# EAGLE schematic PartiBadge-v2 (EAGLE 9.1.3)
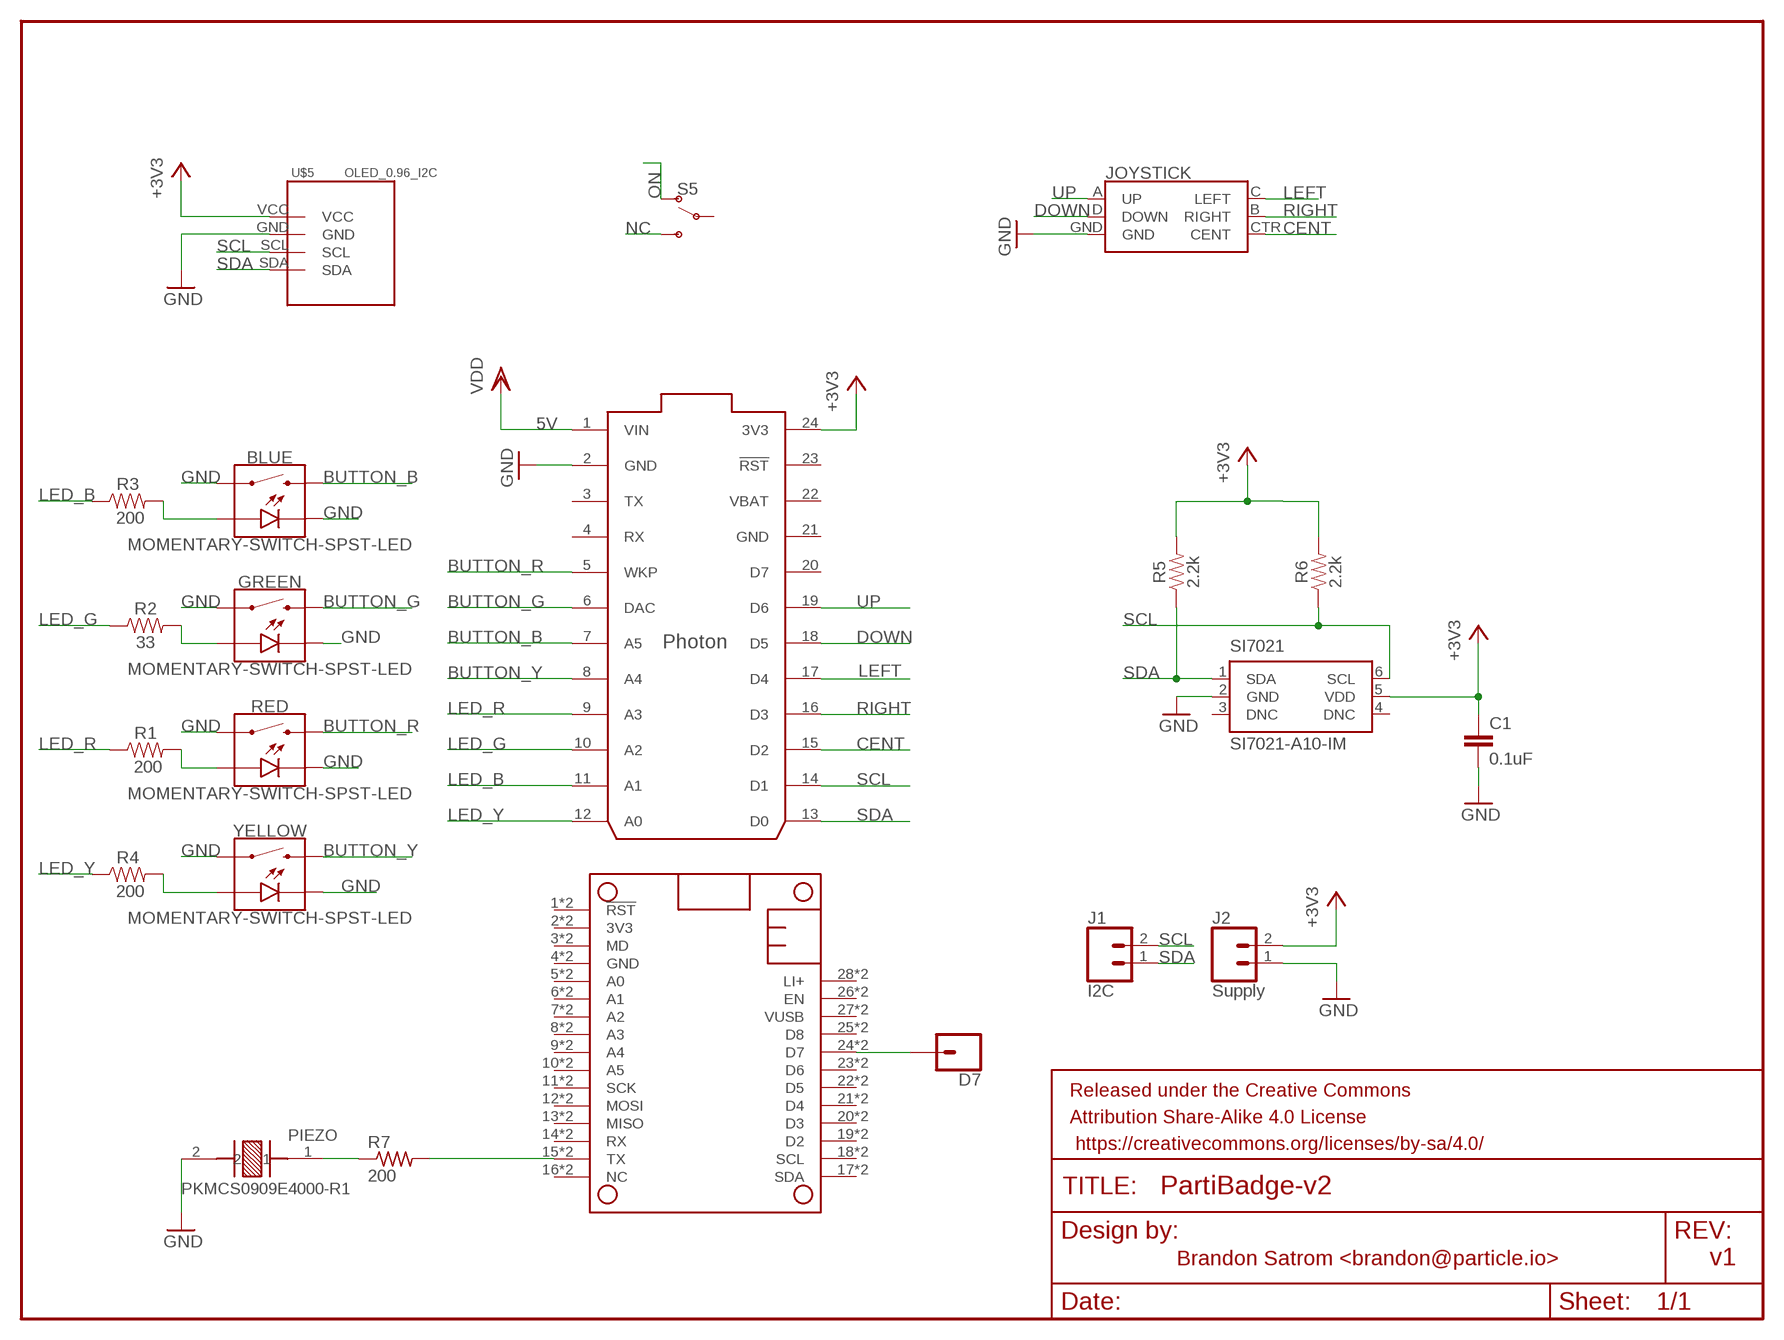
[diagram p0: schematic, sheet 1]

## Parts
BLUE  MOMENTARY-SWITCH-SPST-LED  MOMENTARY-SWITCH-SPST-LED-PTH-12MM-KIT  [TACTILE_SWITCH_LED_PTH_12MM_KIT]
C1  0.1uF  0.1UF-0603-25V-(+80/-20%)  [0603]
D7  CONN_01  [1X01]
GREEN  MOMENTARY-SWITCH-SPST-LED  MOMENTARY-SWITCH-SPST-LED-PTH-12MM-KIT  [TACTILE_SWITCH_LED_PTH_12MM_KIT]
J1  I2C  CONN_02  [1X02]
J2  Supply  CONN_02  [1X02]
JOYSTICK  JOYSTICK_MINI  [JOYSTICK_MINI]
MS1  PARTICLE_MESH_SMTDUAL  [FEATHERWING_SMT2]
PARTIFRAME  FRAME-LETTERNO_PACKAGE  [DUMMY]
PHOTON  PHOTON_WITH_HEADERS  [PHOTON]
PIEZO  PKMCS0909E4000-R1  [XDCR_PKMCS0909E4000-R1]
R1  200  RESISTOR1206  [1206]
R2  33  RESISTOR1206  [1206]
R3  200  RESISTOR1206  [1206]
R4  200  RESISTOR1206  [1206]
R5  2.2k  4.7KOHM-0603-1/10W-1%  [0603]
R6  2.2k  4.7KOHM-0603-1/10W-1%  [0603]
R7  200  R-US_M0805  [M0805]
RED  MOMENTARY-SWITCH-SPST-LED  MOMENTARY-SWITCH-SPST-LED-PTH-12MM-KIT  [TACTILE_SWITCH_LED_PTH_12MM_KIT]
S5  SWITCH-SPDT-PTH-11.6X4.0MM  [SWITCH_SPDT_PTH_11.6X4.0MM]
SI7021  SI7021-A10-IM  [DFN6-3X3]
U$5  OLED_0.96_I2C  [OLED_0.96_I2C]
YELLOW  MOMENTARY-SWITCH-SPST-LED  MOMENTARY-SWITCH-SPST-LED-PTH-12MM-KIT  [TACTILE_SWITCH_LED_PTH_12MM_KIT]

## Nets
5V: PHOTON.1(VIN) ; supply symbol labelled VDD
+3V3: C1.1 J2.2 PHOTON.24(3V3) R5.2 R6.2 SI7021.5(VDD) U$5.VCC
BUTTON_B: BLUE.2 PHOTON.7(A5)
BUTTON_G: GREEN.2 PHOTON.6(DAC)
BUTTON_R: PHOTON.5(WKP) RED.2
BUTTON_Y: PHOTON.8(A4) YELLOW.2
CENT: JOYSTICK.CTR(CENT) PHOTON.15(D2)
DOWN: JOYSTICK.D(DOWN) PHOTON.18(D5)
GND: BLUE.4 BLUE.C C1.2 GREEN.4 GREEN.C J2.1 JOYSTICK.GND PHOTON.2(GND) PIEZO.2 RED.4 RED.C SI7021.2(GND) U$5.GND YELLOW.4 YELLOW.C
LED_B: PHOTON.11(A1) R3.1
LED_G: PHOTON.10(A2) R2.1
LED_R: PHOTON.9(A3) R1.1
LED_Y: PHOTON.12(A0) R4.1
LEFT: JOYSTICK.C(LEFT) PHOTON.17(D4)
N$1: D7.1 MS1.24'(D7) MS1.24(D7)
N$2: MS1.15'(TX) MS1.15(TX) R7.2
N$4: R1.2 RED.A
N$7: GREEN.A R2.2
N$8: BLUE.A R3.2
N$10: R4.2 YELLOW.A
N$13: PIEZO.1 R7.1
NC: S5.3(S)
ON: S5.1(O)
RIGHT: JOYSTICK.B(RIGHT) PHOTON.16(D3)
SCL: J1.2 PHOTON.14(D1) R6.1 SI7021.6(SCL) U$5.SCL
SDA: J1.1 PHOTON.13(D0) R5.1 SI7021.1(SDA) U$5.SDA
UP: JOYSTICK.A(UP) PHOTON.19(D6)
Unconnected: MS1.1'(!RST) MS1.1(!RST) MS1.2'(3V3) MS1.2(3V3) MS1.3'(MD) MS1.3(MD) MS1.5'(A0) MS1.5(A0) MS1.6'(A1) MS1.6(A1) MS1.7'(A2) MS1.7(A2) MS1.8'(A3) MS1.8(A3) MS1.9'(A4) MS1.9(A4) MS1.10'(A5) MS1.10(A5) MS1.11'(SCK) MS1.11(SCK) MS1.12'(MOSI) MS1.12(MOSI) MS1.13'(MISO) MS1.13(MISO) MS1.14'(RX) MS1.14(RX) MS1.16'(NC) MS1.16(NC) MS1.17'(SDA) MS1.17(SDA) MS1.18'(SCL) MS1.18(SCL) MS1.19'(D2) MS1.19(D2) MS1.20'(D3) MS1.20(D3) MS1.21'(D4) MS1.21(D4) MS1.22'(D5) MS1.22(D5) MS1.23'(D6) MS1.23(D6) MS1.25'(D8) MS1.25(D8) MS1.26'(EN) MS1.26(EN) MS1.27'(VUSB) MS1.27(VUSB) MS1.28'(LI+) MS1.28(LI+) PHOTON.3(TX) PHOTON.4(RX) PHOTON.20(D7) PHOTON.23(!RST) S5.2(P) SI7021.3(DNC) SI7021.4(DNC)

## Notes on the sheet
- Brandon Satrom <brandon@particle.io> | v1

## Power pins joined to a net without a drawn wire
GND: MS1.4'(GND) MS1.4(GND) PHOTON.21(GND)
VBAT: PHOTON.22(VBAT)

## Library data of the parts
BLUE GREEN RED YELLOW = SparkFun-Switches:MOMENTARY-SWITCH-SPST-LED: Momentary Switch (Pushbutton) - SPST - w/ LED Normally-open (NO) SPST momentary switches (buttons, pushbuttons), with a built-in LED. Variants PTH-CHERRY - Cherry MX Switch Cherry MX Keyswitches are top-of-the-line mechanical keyboard switches. They’re satisfyingly “clicky”, reliable up to tens-of-millions of key presses, and a standard in gaming and programming keyboards across the globe. This ‘blue’ version Cherry MX Switch is favored by most due to its secondary internal actuator making it less likely to “double-tap.” If you are looking for a noticeably audible and high-quality key switch, this is the perfect option for you! Cherry MX Switch <https://www.sparkfun.com/products/13834> (COM-13834) Cherry MX Switch Breakout <https://www.sparkfun.com/products/13773> (BOB-13773) PTH-12MM and PTH-12MM-KIT - 12mm Illuminated LED KIT variant is for soldering kits. There is no tStop (covering up the top side of the pads with mask). This helps the beginner see which side they should be soldering too. LED Tactile Button Breakout <https://www.sparkfun.com/products/10467> (BOB-10467) LED Tactile Button - Red <https://www.sparkfun.com/products/10442> (COM-10442) LED Tactile Button - Blue <https://www.sparkfun.com/products/10443> (COM-10443) LED Tactile Button - Green <https://www.sparkfun.com/products/10440> (COM-10440) LED Tactile Button - Orange <https://www.sparkfun.com/products/10441> (COM-10441) LED Tactile Button - White <https://www.sparkfun.com/products/10439> (COM-10439); PROD_ID: SWCH-11758; SF_SKU: COM-10442
C1 = SparkFun-Capacitors:0.1UF: 0.1µF ceramic capacitors A capacitor is a passive two-terminal electrical component used to store electrical energy temporarily in an electric field.; PROD_ID: CAP-00810
D7 = SparkFun-Connectors:CONN_01: Single connection point. Often used as Generic Header-pin footprint for 0.1 inch spaced/style header connections On any of the 0.1 inch spaced packages, you can populate with these: Break Away Headers - Straight <https://www.sparkfun.com/products/116> (PRT-00116) Break Away Male Headers - Right Angle <https://www.sparkfun.com/products/553> (PRT-00553) Female Headers <https://www.sparkfun.com/products/115> (PRT-00115) Break Away Headers - Machine Pin <https://www.sparkfun.com/products/117> (PRT-00117) Break Away Female Headers - Swiss Machine Pin <https://www.sparkfun.com/products/743> (PRT-00743) This device is also useful as a general connection point to wire up your design to another part of your project. Our various solder wires solder well into these plated through hole pads. Hook-Up Wire - Assortment (Stranded, 22 AWG) <https://www.sparkfun.com/products/11375> (PRT-11375) Hook-Up Wire - Assortment (Solid Core, 22 AWG) <https://www.sparkfun.com/products/11367> (PRT-11367) View the entire wire category on our website here <https://www.sparkfun.com/categories/141> Special notes: SMTSO-256-ET is a "flush mount" nut for a 4-40 screw. We mostly use this on specialty testbeds; it is a nice way to connect hardware to your PCB at an adjustable hieght. Also note, the SNAP packages are for using a snappable style connector. We sell a baggie of snaps and they are also used on two LilyPad designs: Snap Assortment - 30 pack (male and female) <https://www.sparkfun.com/products/11347> (DEV-11347) LilyPad Arduino SimpleSnap <https://www.sparkfun.com/products/10941> (DEV-10941) LilyPad SimpleSnap Protoboard <https://www.sparkfun.com/products/10940> (DEV-10940)
J1 J2 = SparkFun-Connectors:CONN_02: Multi connection point. Often used as Generic Header-pin footprint for 0.1 inch spaced/style header connections On any of the 0.1 inch spaced packages, you can populate with these: Break Away Headers - Straight <https://www.sparkfun.com/products/116> (PRT-00116) Break Away Male Headers - Right Angle <https://www.sparkfun.com/products/553> (PRT-00553) Female Headers <https://www.sparkfun.com/products/115> (PRT-00115) Break Away Headers - Machine Pin <https://www.sparkfun.com/products/117> (PRT-00117) Break Away Female Headers - Swiss Machine Pin <https://www.sparkfun.com/products/743> (PRT-00743) For SCREWTERMINALS and SPRING TERMINALS visit here: Screw Terimnals on SparkFun.com <https://www.sparkfun.com/search/results?term=Screw+Terminals> (5mm/3.5mm/2.54mm spacing) This device is also useful as a general connection point to wire up your design to another part of your project. Our various solder wires solder well into these plated through hole pads. Hook-Up Wire - Assortment (Stranded, 22 AWG) <https://www.sparkfun.com/products/11375> (PRT-11375) Hook-Up Wire - Assortment (Solid Core, 22 AWG) <https://www.sparkfun.com/products/11367> (PRT-11367) View the entire wire category on our website here <https://www.sparkfun.com/categories/141> Special notes: Molex polarized connector foot print use with: PRT-08233 with associated crimp pins and housings. 2.54_SCREWTERM for use with PRT-10571. 3.5mm Screw Terminal footprints for PRT-08084 5mm Screw Terminal footprints for use with PRT-08432
JOYSTICK = SparkFun-Switches:JOYSTICK_MINI: Small Tactile Joystick w/ Select Switch A 5-way tactile switch allows for a joystick-like interface in a very small package. Part #: 4UCON SF303GJ26 SparkFun Products 5-way Tactile Switch <https://www.sparkfun.com/products/10063> (COM-10063) Used on SparkFun Block for Intel® Edison - OLED <https://www.sparkfun.com/products/13035> (DEV-13035) Used on CAN-BUS Shield <https://www.sparkfun.com/products/13262> (DEV-13262); PROD_ID: SWCH-09905; SF_SKU: COM-10063
MS1 = Particle-Mesh:PARTICLE_MESH
PARTIFRAME = SparkFun-Aesthetics:FRAME-LETTER: Schematic Frame - Letter Standard 8.5x11 US Letter frame; DESIGNER: Brandon Satrom; VERSION: v01
PHOTON = Particle-Devices:PHOTON: Particle Photon Wi-Fi through-hole development board footprint
PIEZO = PKMCS0909E4000-R1:PKMCS0909E4000-R1: Audio Sounder Piezo Solder Pad Surface Mount; AVAILABILITY: Good; DESCRIPTION: Audio Sounder Piezo Solder Pad Surface Mount; MF: Murata; MP: PKMCS0909E4000-R1; PACKAGE: 2010 Murata; PRICE: 1.02 USD
R1-R4 = SparkFun-Resistors:RESISTOR: Generic Resistor Package
R5 R6 = SparkFun-Resistors:4.7KOHM: 4.7kΩ resistor A resistor is a passive two-terminal electrical component that implements electrical resistance as a circuit element. Resistors act to reduce current flow, and, at the same time, act to lower voltage levels within circuits. - Wikipedia; PROD_ID: RES-07857; VALUE: 4.7k
R7 = rcl:R-US_: RESISTOR, American symbol; SPICEPREFIX: R
S5 = SparkFun-Switches:SWITCH-SPDT: Single Pole, Double Throw (SPDT) Switch Single-pole, double-throw (SPDT) switch. Variant Overview SMD-AYZ0202 Surface Mount DPDT Switch <https://www.sparkfun.com/products/597> (COM-00597) Used on e.g. LilyPad Arduino USB - ATmega32U4 Board <https://www.sparkfun.com/products/12049> PTH-11.6X4.0MM SPDT Mini Power Switch <https://www.sparkfun.com/products/102> (COM-00102) Used on e.g. SparkFun Simon Says - Through-Hole Soldering Kit <https://www.sparkfun.com/products/10547> (KIT-10547) PTH-11.6X4.0MM-KIT KIT version of SPDT Mini Power Switch - Simplifies soldering by removing tStop of switch pins - only one side can be soldered. PTH-11.6X4.0MM-LOCK LOCK version of SPDT Mini Power Switch - Offset pins hold switch in place for easier soldering. SMD-RIGHT-ANGLE Surface Mount Right Angle Switch <https://www.sparkfun.com/products/10860> (COM-10860) Used on e.g. SparkFun ESP8266 Thing <https://www.sparkfun.com/products/13231>; PROD_ID: SWCH-08261; SF_SKU: COM-00102
SI7021 = si70xx-10:SI7021-*: I2C Humidity and Temperature Sensor Source: http://www.silabs.com/Support%20Documents/TechnicalDocs/Si7021.pdf; MF: Silicon Labs; MPN: Si7021-A10-IM; OC_FARNELL: 2422573; OC_NEWARK: 55X3113
U$5 = tft_1.8_1.44_oled_0.96:OLED_0.96_I2C